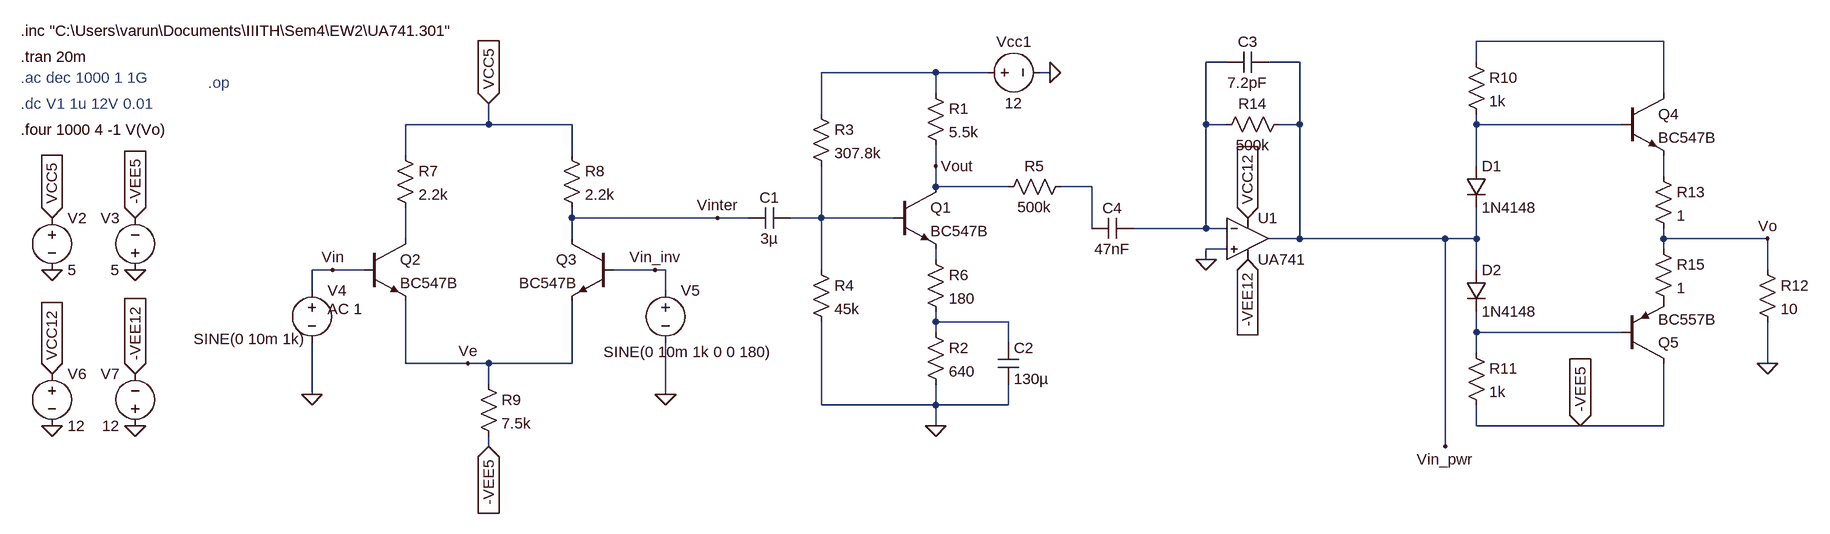
[diagram p0: schematic AudioAmp1.asc]
AudioAmp1.asc, the LTspice schematic file:
Version 4
SHEET 1 3268 888
WIRE 2544 -128 2256 -128
WIRE 1872 -96 1840 -96
WIRE 1984 -96 1936 -96
WIRE 2256 -96 2256 -128
WIRE 1424 -80 1248 -80
WIRE 1504 -80 1424 -80
WIRE 1600 -80 1584 -80
WIRE 1424 -48 1424 -80
WIRE 2544 -48 2544 -128
WIRE 1248 -16 1248 -80
WIRE 736 0 736 -32
WIRE 736 0 608 0
WIRE 864 0 736 0
WIRE 1840 0 1840 -96
WIRE 1872 0 1840 0
WIRE 1984 0 1984 -96
WIRE 1984 0 1952 0
WIRE 2256 0 2256 -16
WIRE 2480 0 2256 0
WIRE 608 48 608 0
WIRE 864 48 864 0
WIRE 1424 64 1424 32
WIRE 2256 64 2256 0
WIRE 2544 80 2544 48
WIRE 1424 96 1424 64
WIRE 1536 96 1424 96
WIRE 1664 96 1616 96
WIRE 864 144 864 128
WIRE 1088 144 864 144
WIRE 1136 144 1088 144
WIRE 1248 144 1248 64
WIRE 1248 144 1200 144
WIRE 1360 144 1248 144
WIRE 1664 160 1664 96
WIRE 1840 160 1840 0
WIRE 1840 160 1728 160
WIRE 1872 160 1840 160
WIRE 608 176 608 128
WIRE 864 176 864 144
WIRE 1984 176 1984 0
WIRE 1984 176 1936 176
WIRE 2208 176 1984 176
WIRE 2256 176 2256 128
WIRE 2256 176 2208 176
WIRE 2544 176 2544 160
WIRE 2704 176 2544 176
WIRE 1872 192 1840 192
WIRE 2544 192 2544 176
WIRE 1424 208 1424 192
WIRE 1840 208 1840 192
WIRE 496 224 464 224
WIRE 544 224 496 224
WIRE 992 224 928 224
WIRE 1008 224 992 224
WIRE 1248 224 1248 144
WIRE 2256 224 2256 176
WIRE 2704 224 2704 176
WIRE 464 256 464 224
WIRE 1008 256 1008 224
WIRE 1424 304 1424 288
WIRE 1536 304 1424 304
WIRE 1424 320 1424 304
WIRE 2256 320 2256 288
WIRE 2480 320 2256 320
WIRE 1536 336 1536 304
WIRE 2256 352 2256 320
WIRE 608 368 608 272
WIRE 704 368 608 368
WIRE 736 368 704 368
WIRE 864 368 864 272
WIRE 864 368 736 368
WIRE 2704 368 2704 304
WIRE 736 400 736 368
WIRE 464 416 464 336
WIRE 1008 416 1008 336
WIRE 1248 432 1248 304
WIRE 1424 432 1424 400
WIRE 1424 432 1248 432
WIRE 1536 432 1536 400
WIRE 1536 432 1424 432
WIRE 1424 464 1424 432
WIRE 2256 464 2256 432
WIRE 2416 464 2256 464
WIRE 2544 464 2544 368
WIRE 2544 464 2416 464
WIRE 736 496 736 480
WIRE 2208 496 2208 176
FLAG 1600 -80 0
FLAG 1088 144 Vinter
FLAG 1424 64 Vout
FLAG 464 416 0
FLAG 1008 416 0
FLAG 496 224 Vin
FLAG 992 224 Vin_inv
FLAG 704 368 Ve
FLAG 192 224 0
FLAG 64 224 0
FLAG 64 144 VCC5
IOPIN 64 144 In
FLAG 192 144 -VEE5
IOPIN 192 144 In
FLAG 736 496 -VEE5
IOPIN 736 496 In
FLAG 736 -32 VCC5
IOPIN 736 -32 In
FLAG 2704 176 Vo
FLAG 2416 464 -VEE5
IOPIN 2416 464 In
FLAG 64 384 VCC12
IOPIN 64 384 In
FLAG 192 464 0
FLAG 64 464 0
FLAG 192 384 -VEE12
IOPIN 192 384 In
FLAG 1904 144 VCC12
IOPIN 1904 144 In
FLAG 1904 208 -VEE12
IOPIN 1904 208 In
FLAG 1840 208 0
FLAG 2208 496 Vin_pwr
FLAG 1424 464 0
FLAG 2704 368 0
SYMBOL npn 1360 96 R0
SYMATTR InstName Q1
SYMATTR Value BC547B
SYMBOL res 1408 -64 R0
SYMATTR InstName R1
SYMATTR Value 5.5k
SYMBOL res 1408 304 R0
SYMATTR InstName R2
SYMATTR Value 640
SYMBOL voltage 1488 -80 R270
WINDOW 0 32 56 VTop 2
WINDOW 3 -32 56 VBottom 2
WINDOW 123 0 0 Left 0
WINDOW 39 0 0 Left 0
SYMATTR InstName Vcc1
SYMATTR Value 12
SYMBOL res 1232 -32 R0
SYMATTR InstName R3
SYMATTR Value 307.8k
SYMBOL res 1232 208 R0
SYMATTR InstName R4
SYMATTR Value 45k
SYMBOL cap 1200 128 R90
WINDOW 0 0 32 VBottom 2
WINDOW 3 32 32 VTop 2
SYMATTR InstName C1
SYMATTR Value 3µ
SYMBOL res 1408 192 R0
SYMATTR InstName R6
SYMATTR Value 180
SYMBOL cap 1520 336 R0
SYMATTR InstName C2
SYMATTR Value 130µ
SYMBOL res 592 32 R0
SYMATTR InstName R7
SYMATTR Value 2.2k
SYMBOL res 848 32 R0
SYMATTR InstName R8
SYMATTR Value 2.2k
SYMBOL npn 544 176 R0
SYMATTR InstName Q2
SYMATTR Value BC547B
SYMBOL npn 928 176 M0
SYMATTR InstName Q3
SYMATTR Value BC547B
SYMBOL res 720 384 R0
SYMATTR InstName R9
SYMATTR Value 7.5k
SYMBOL voltage 64 128 R0
SYMATTR InstName V2
SYMATTR Value 5
SYMBOL voltage 192 240 R180
WINDOW 0 24 96 Left 2
WINDOW 3 24 16 Left 2
SYMATTR InstName V3
SYMATTR Value 5
SYMBOL voltage 464 240 R0
WINDOW 123 24 44 Left 2
WINDOW 39 0 0 Left 0
WINDOW 3 -182 90 Left 2
SYMATTR Value2 AC 1
SYMATTR Value SINE(0 10m 1k)
SYMATTR InstName V4
SYMBOL voltage 1008 240 R0
WINDOW 123 30 110 Left 2
WINDOW 39 0 0 Left 0
WINDOW 3 -95 110 Left 2
SYMATTR Value SINE(0 10m 1k 0 0 180)
SYMATTR InstName V5
SYMBOL diode 2240 64 R0
SYMATTR InstName D1
SYMATTR Value 1N4148
SYMBOL diode 2240 224 R0
SYMATTR InstName D2
SYMATTR Value 1N4148
SYMBOL res 2240 -112 R0
SYMATTR InstName R10
SYMATTR Value 1k
SYMBOL res 2240 336 R0
SYMATTR InstName R11
SYMATTR Value 1k
SYMBOL npn 2480 -48 R0
SYMATTR InstName Q4
SYMATTR Value BC547B
SYMBOL pnp 2480 368 M180
SYMATTR InstName Q5
SYMATTR Value BC557B
SYMBOL res 2688 208 R0
SYMATTR InstName R12
SYMATTR Value 10
SYMBOL OpAmps\\opamp2 1904 112 R0
SYMATTR InstName U1
SYMATTR Value UA741
SYMBOL voltage 64 368 R0
SYMATTR InstName V6
SYMATTR Value 12
SYMBOL voltage 192 480 R180
WINDOW 0 24 96 Left 2
WINDOW 3 24 16 Left 2
SYMATTR InstName V7
SYMATTR Value 12
SYMBOL res 1632 80 R90
WINDOW 0 0 56 VBottom 2
WINDOW 3 32 56 VTop 2
SYMATTR InstName R5
SYMATTR Value 500k
SYMBOL res 2528 64 R0
SYMATTR InstName R13
SYMATTR Value 1
SYMBOL res 2528 176 R0
SYMATTR InstName R15
SYMATTR Value 1
SYMBOL cap 1936 -112 R90
WINDOW 0 0 32 VBottom 2
WINDOW 3 32 32 VTop 2
SYMATTR InstName C3
SYMATTR Value 7.2pF
SYMBOL res 1968 -16 R90
WINDOW 0 0 56 VBottom 2
WINDOW 3 32 56 VTop 2
SYMATTR InstName R14
SYMATTR Value 500k
SYMBOL cap 1728 144 R90
WINDOW 0 0 32 VBottom 2
WINDOW 3 32 32 VTop 2
SYMATTR InstName C4
SYMATTR Value 47nF
TEXT 16 -32 Left 2 ;.dc V1 1u 12V 0.01
TEXT 16 8 Left 2 !.four 1000 4 -1 V(Vo)
TEXT 304 -64 Left 2 ;.op
TEXT 16 -104 Left 2 !.tran 20m
TEXT 16 -72 Left 2 ;.ac dec 1000 1 1G
TEXT 16 -144 Left 2 !.inc "C:\\Users\\varun\\Documents\\IIITH\\Sem4\\EW2\\UA741.301"

The netlist it stands for:
* AudioAmp1.asc
Q1 Vout N007 N009 0 BC547B
R1 N003 Vout 5.5k
R2 N010 0 640
Vcc1 N003 0 12
R3 N003 N007 307.8k
R4 N007 0 45k
C1 N007 Vinter 3µ
R6 N009 N010 180
C2 N010 0 130µ
R7 VCC5 N008 2.2k
R8 VCC5 Vinter 2.2k
Q2 N008 Vin Ve 0 BC547B
Q3 Vinter Vin_inv Ve 0 BC547B
R9 Ve -VEE5 7.5k
V2 VCC5 0 5
V3 0 -VEE5 5
V4 Vin 0 SINE(0 10m 1k) AC 1
V5 Vin_inv 0 SINE(0 10m 1k 0 0 180)
D1 N004 Vin_pwr 1N4148
D2 Vin_pwr N011 1N4148
R10 N001 N004 1k
R11 N011 -VEE5 1k
Q4 N001 N004 N005 0 BC547B
Q5 -VEE5 N011 P001 0 BC557B
R12 Vo 0 10
XU1 0 N002 VCC12 -VEE12 Vin_pwr UA741  ; pins In+ In- V+ V- OUT
V6 VCC12 0 12
V7 0 -VEE12 12
R5 N006 Vout 500k
R13 N005 Vo 1
R15 Vo P001 1
C3 Vin_pwr N002 7.2pF
R14 Vin_pwr N002 500k
C4 N002 N006 47nF
.model D D
.lib standard.dio
.model NPN NPN
.model PNP PNP
.lib standard.bjt
* .dc V1 1u 12V 0.01
.four 1000 4 -1 V(Vo)
* .op
.tran 20m
* .ac dec 1000 1 1G
.inc "C:\Users\varun\Documents\IIITH\Sem4\EW2\UA741.301"
.backanno
.end